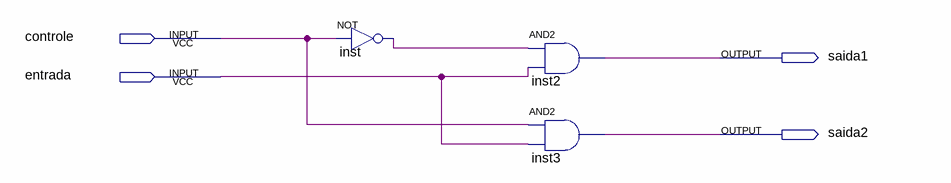
[diagram p0: schematic sheet]
// Quartus schematic demultiplexador.bdf as structural Verilog: 3 symbols, 4 pins
module demultiplexador (
  input  controle,
  input  entrada,
  output saida1,
  output saida2
);

  wire inst_out;

  not inst (inst_out, controle);
  and inst2 (saida1, inst_out, entrada);
  and inst3 (saida2, controle, entrada);
endmodule
